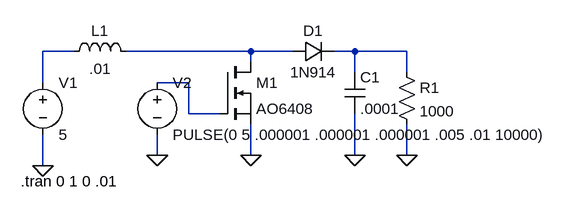
[diagram p0: schematic Boost.asc]
Boost.asc, the LTspice schematic file:
Version 4
SHEET 1 924 680
WIRE 64 64 16 64
WIRE 336 64 144 64
WIRE 400 64 336 64
WIRE 496 64 464 64
WIRE 576 64 496 64
WIRE 336 80 336 64
WIRE 496 96 496 64
WIRE 576 96 576 64
WIRE 16 112 16 64
WIRE 240 112 192 112
WIRE 240 160 240 112
WIRE 288 160 240 160
WIRE 192 224 192 192
WIRE 336 224 336 176
WIRE 496 224 496 160
WIRE 576 224 576 176
WIRE 16 240 16 192
FLAG 336 224 0
FLAG 192 224 0
FLAG 16 240 0
FLAG 496 224 0
FLAG 576 224 0
SYMBOL voltage 16 96 R0
WINDOW 123 0 0 Left 2
WINDOW 39 0 0 Left 2
SYMATTR InstName V1
SYMATTR Value 5
SYMBOL ind 48 80 R270
WINDOW 0 32 56 VTop 2
WINDOW 3 5 56 VBottom 2
SYMATTR InstName L1
SYMATTR Value .01
SYMATTR SpiceLine Rser=10 Rpar=1000
SYMBOL nmos 288 80 R0
SYMATTR InstName M1
SYMATTR Value AO6408
SYMBOL diode 400 80 R270
WINDOW 0 32 32 VTop 2
WINDOW 3 0 32 VBottom 2
SYMATTR InstName D1
SYMATTR Value 1N914
SYMBOL cap 480 96 R0
SYMATTR InstName C1
SYMATTR Value .0001
SYMBOL res 560 80 R0
SYMATTR InstName R1
SYMATTR Value 1000
SYMBOL voltage 192 96 R0
WINDOW 123 0 0 Left 2
WINDOW 39 0 0 Left 2
SYMATTR InstName V2
SYMATTR Value PULSE(0 5 .000001 .000001 .000001 .005 .01 10000)
TEXT -18 264 Left 2 !.tran 0 1 0 .01

The netlist it stands for:
* Boost.asc
V1 N001 0 5
L1 N001 N002 .01 Rser=10 Rpar=1000
M1 N002 N004 0 0 AO6408
D1 N002 N003 1N914
C1 N003 0 .0001
R1 N003 0 1000
V2 N004 0 PULSE(0 5 .000001 .000001 .000001 .005 .01 10000)
.model D D
.lib standard.dio
.model NMOS NMOS
.model PMOS PMOS
.lib standard.mos
.tran 0 1 0 .01
.backanno
.end